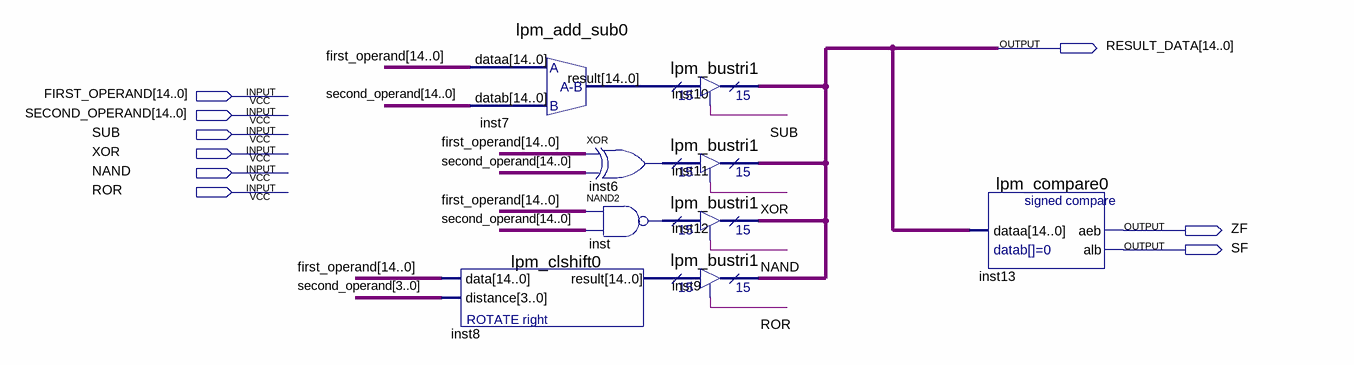
[diagram p0: schematic sheet]
// Quartus schematic ALU.bdf as structural Verilog: 9 symbols, 9 pins
module ALU (
  input  [14:0] FIRST_OPERAND,
  input  [14:0] SECOND_OPERAND,
  input  SUB,
  input  XOR,
  input  NAND,
  input  ROR,
  output [14:0] RESULT_DATA,
  output ZF,
  output SF
);

  wire [14:0] inst6_out, inst7_result, inst8_result, inst_out;

  lpm_add_sub0 inst7 (.dataa(FIRST_OPERAND), .datab(SECOND_OPERAND), .result(inst7_result));
  lpm_clshift0 inst8 (.data(FIRST_OPERAND), .distance(SECOND_OPERAND[3:0]), .result(inst8_result));
  assign inst6_out = FIRST_OPERAND ^ SECOND_OPERAND;  // XOR inst6, 15 bits wide
  assign inst_out = ~(FIRST_OPERAND & SECOND_OPERAND);  // NAND2 inst, 15 bits wide
  lpm_bustri1 inst10 (.enabledt(SUB), .data(inst7_result), .tridata(RESULT_DATA));
  lpm_bustri1 inst11 (.enabledt(XOR), .data(inst6_out), .tridata(RESULT_DATA));
  lpm_bustri1 inst12 (.enabledt(NAND), .data(inst_out), .tridata(RESULT_DATA));
  lpm_bustri1 inst9 (.enabledt(ROR), .data(inst8_result), .tridata(RESULT_DATA));
  lpm_compare0 inst13 (.dataa(RESULT_DATA), .aeb(ZF), .alb(SF));
endmodule
